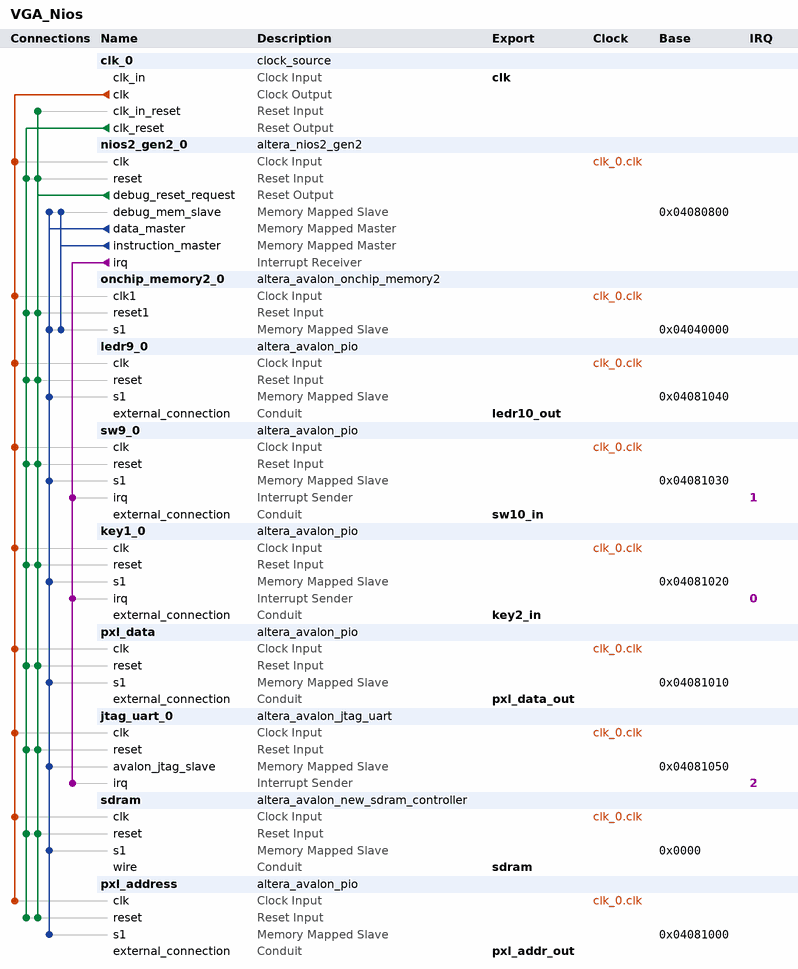
[diagram p0: system contents]
# Platform Designer (Qsys) system VGA_Nios, MAX 10 10M50DAF484C7G
# Parameters at their usual value, and those the tool derives, are not listed.
package require -exact qsys 18.1
create_system VGA_Nios
set_project_property DEVICE_FAMILY {MAX 10}
set_project_property DEVICE 10M50DAF484C7G

add_instance clk_0 clock_source 18.1
set_instance_parameter_value clk_0 clockFrequency 50000000

add_instance nios2_gen2_0 altera_nios2_gen2 18.1
set_instance_parameter_value nios2_gen2_0 dcache_size 2048
set_instance_parameter_value nios2_gen2_0 exceptionSlave onchip_memory2_0.s1
set_instance_parameter_value nios2_gen2_0 icache_size 4096
set_instance_parameter_value nios2_gen2_0 impl Fast
set_instance_parameter_value nios2_gen2_0 resetSlave onchip_memory2_0.s1

add_instance onchip_memory2_0 altera_avalon_onchip_memory2 18.1
set_instance_parameter_value onchip_memory2_0 dataWidth 32
set_instance_parameter_value onchip_memory2_0 dualPort false
set_instance_parameter_value onchip_memory2_0 initMemContent false
set_instance_parameter_value onchip_memory2_0 initializationFileName onchip_mem.hex
set_instance_parameter_value onchip_memory2_0 memorySize 132000

add_instance ledr9_0 altera_avalon_pio 18.1
set_instance_parameter_value ledr9_0 direction Output
set_instance_parameter_value ledr9_0 width 10

add_instance sw9_0 altera_avalon_pio 18.1
set_instance_parameter_value sw9_0 direction Input
set_instance_parameter_value sw9_0 generateIRQ true
set_instance_parameter_value sw9_0 width 10

add_instance key1_0 altera_avalon_pio 18.1
set_instance_parameter_value key1_0 direction Input
set_instance_parameter_value key1_0 generateIRQ true
set_instance_parameter_value key1_0 width 2

add_instance pxl_data altera_avalon_pio 18.1
set_instance_parameter_value pxl_data direction Output
set_instance_parameter_value pxl_data width 4

add_instance jtag_uart_0 altera_avalon_jtag_uart 18.1
set_instance_parameter_value jtag_uart_0 simInteractiveOptions NO_INTERACTIVE_WINDOWS

add_instance sdram altera_avalon_new_sdram_controller 18.1
set_instance_parameter_value sdram TAC 5.5
set_instance_parameter_value sdram TRCD 20.0
set_instance_parameter_value sdram TRP 20.0
set_instance_parameter_value sdram casLatency 3
set_instance_parameter_value sdram columnWidth 10
set_instance_parameter_value sdram dataWidth 16
set_instance_parameter_value sdram generateSimulationModel false
set_instance_parameter_value sdram model single_Micron_MT48LC4M32B2_7_chip
set_instance_parameter_value sdram numberOfBanks 4
set_instance_parameter_value sdram numberOfChipSelects 1
set_instance_parameter_value sdram powerUpDelay 100.0
set_instance_parameter_value sdram refreshPeriod 15.625
set_instance_parameter_value sdram rowWidth 13

add_instance pxl_address altera_avalon_pio 18.1
set_instance_parameter_value pxl_address direction Output
set_instance_parameter_value pxl_address width 14

# connections
add_connection clk_0.clk jtag_uart_0.clk clock
add_connection clk_0.clk key1_0.clk clock
add_connection clk_0.clk ledr9_0.clk clock
add_connection clk_0.clk nios2_gen2_0.clk clock
add_connection clk_0.clk onchip_memory2_0.clk1 clock
add_connection clk_0.clk pxl_address.clk clock
add_connection clk_0.clk pxl_data.clk clock
add_connection clk_0.clk sdram.clk clock
add_connection clk_0.clk sw9_0.clk clock
add_connection clk_0.clk_reset jtag_uart_0.reset reset
add_connection clk_0.clk_reset key1_0.reset reset
add_connection clk_0.clk_reset ledr9_0.reset reset
add_connection clk_0.clk_reset nios2_gen2_0.reset reset
add_connection clk_0.clk_reset onchip_memory2_0.reset1 reset
add_connection clk_0.clk_reset pxl_address.reset reset
add_connection clk_0.clk_reset pxl_data.reset reset
add_connection clk_0.clk_reset sdram.reset reset
add_connection clk_0.clk_reset sw9_0.reset reset
add_connection nios2_gen2_0.debug_reset_request clk_0.clk_in_reset reset
add_connection nios2_gen2_0.debug_reset_request jtag_uart_0.reset reset
add_connection nios2_gen2_0.debug_reset_request key1_0.reset reset
add_connection nios2_gen2_0.debug_reset_request ledr9_0.reset reset
add_connection nios2_gen2_0.debug_reset_request nios2_gen2_0.reset reset
add_connection nios2_gen2_0.debug_reset_request onchip_memory2_0.reset1 reset
add_connection nios2_gen2_0.debug_reset_request pxl_address.reset reset
add_connection nios2_gen2_0.debug_reset_request pxl_data.reset reset
add_connection nios2_gen2_0.debug_reset_request sdram.reset reset
add_connection nios2_gen2_0.debug_reset_request sw9_0.reset reset
add_connection nios2_gen2_0.data_master jtag_uart_0.avalon_jtag_slave avalon
set_connection_parameter_value nios2_gen2_0.data_master/jtag_uart_0.avalon_jtag_slave baseAddress 0x04081050
add_connection nios2_gen2_0.data_master key1_0.s1 avalon
set_connection_parameter_value nios2_gen2_0.data_master/key1_0.s1 baseAddress 0x04081020
add_connection nios2_gen2_0.data_master ledr9_0.s1 avalon
set_connection_parameter_value nios2_gen2_0.data_master/ledr9_0.s1 baseAddress 0x04081040
add_connection nios2_gen2_0.data_master nios2_gen2_0.debug_mem_slave avalon
set_connection_parameter_value nios2_gen2_0.data_master/nios2_gen2_0.debug_mem_slave baseAddress 0x04080800
add_connection nios2_gen2_0.data_master onchip_memory2_0.s1 avalon
set_connection_parameter_value nios2_gen2_0.data_master/onchip_memory2_0.s1 baseAddress 0x04040000
add_connection nios2_gen2_0.data_master pxl_address.s1 avalon
set_connection_parameter_value nios2_gen2_0.data_master/pxl_address.s1 baseAddress 0x04081000
add_connection nios2_gen2_0.data_master pxl_data.s1 avalon
set_connection_parameter_value nios2_gen2_0.data_master/pxl_data.s1 baseAddress 0x04081010
add_connection nios2_gen2_0.data_master sdram.s1 avalon
set_connection_parameter_value nios2_gen2_0.data_master/sdram.s1 baseAddress 0x0000
add_connection nios2_gen2_0.data_master sw9_0.s1 avalon
set_connection_parameter_value nios2_gen2_0.data_master/sw9_0.s1 baseAddress 0x04081030
add_connection nios2_gen2_0.instruction_master nios2_gen2_0.debug_mem_slave avalon
set_connection_parameter_value nios2_gen2_0.instruction_master/nios2_gen2_0.debug_mem_slave baseAddress 0x04080800
add_connection nios2_gen2_0.instruction_master onchip_memory2_0.s1 avalon
set_connection_parameter_value nios2_gen2_0.instruction_master/onchip_memory2_0.s1 baseAddress 0x04040000
add_connection nios2_gen2_0.irq jtag_uart_0.irq interrupt
set_connection_parameter_value nios2_gen2_0.irq/jtag_uart_0.irq irqNumber 2
add_connection nios2_gen2_0.irq key1_0.irq interrupt
set_connection_parameter_value nios2_gen2_0.irq/key1_0.irq irqNumber 0
add_connection nios2_gen2_0.irq sw9_0.irq interrupt
set_connection_parameter_value nios2_gen2_0.irq/sw9_0.irq irqNumber 1

# exported interfaces
add_interface clk clock sink
set_interface_property clk EXPORT_OF clk_0.clk_in
add_interface key2_in conduit end
set_interface_property key2_in EXPORT_OF key1_0.external_connection
add_interface ledr10_out conduit end
set_interface_property ledr10_out EXPORT_OF ledr9_0.external_connection
add_interface pxl_addr_out conduit end
set_interface_property pxl_addr_out EXPORT_OF pxl_address.external_connection
add_interface pxl_data_out conduit end
set_interface_property pxl_data_out EXPORT_OF pxl_data.external_connection
add_interface sdram conduit end
set_interface_property sdram EXPORT_OF sdram.wire
add_interface sw10_in conduit end
set_interface_property sw10_in EXPORT_OF sw9_0.external_connection

set_interconnect_requirement {$system} qsys_mm.clockCrossingAdapter HANDSHAKE
set_interconnect_requirement {$system} qsys_mm.enableEccProtection FALSE
set_interconnect_requirement {$system} qsys_mm.insertDefaultSlave FALSE
set_interconnect_requirement {$system} qsys_mm.maxAdditionalLatency 1

save_system VGA_Nios.qsys
